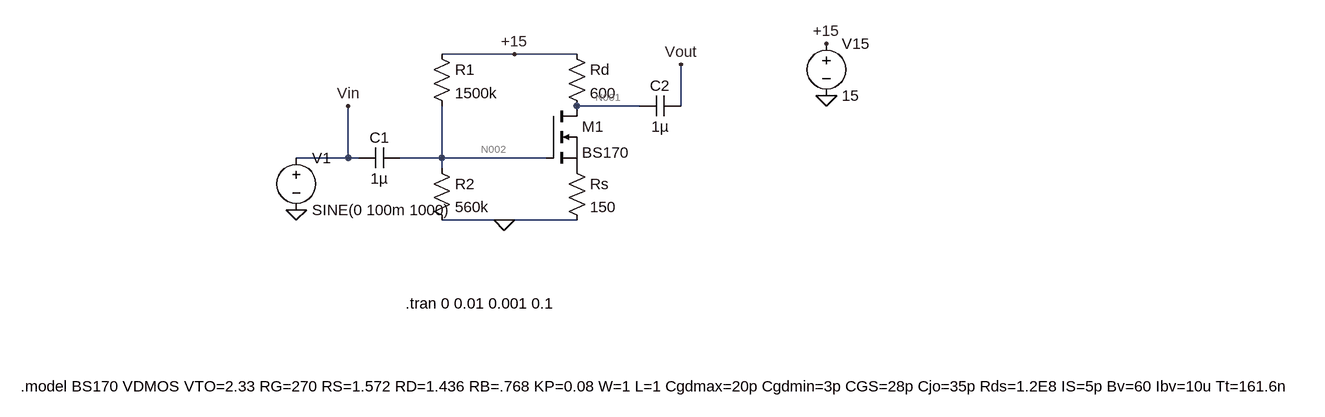
[diagram p0: schematic lab3.asc]
lab3.asc, the LTspice schematic file:
Version 4
SHEET 1 2216 680
WIRE -112 48 -224 48
WIRE -16 48 -112 48
WIRE 80 128 -16 128
WIRE 144 128 144 64
WIRE -368 208 -368 128
WIRE -368 208 -448 208
WIRE -352 208 -368 208
WIRE -224 208 -224 128
WIRE -224 208 -288 208
WIRE -64 208 -224 208
WIRE -224 224 -224 208
WIRE -128 304 -224 304
WIRE -16 304 -128 304
FLAG -128 304 0
FLAG 368 112 0
FLAG -112 48 +15
FLAG -448 288 0
FLAG 368 32 +15
FLAG -368 128 Vin
FLAG 144 64 Vout
SYMBOL nmos -64 128 R0
SYMATTR InstName M1
SYMATTR Value BS170
SYMBOL res -32 208 R0
SYMATTR InstName Rs
SYMATTR Value 150
SYMBOL res -32 32 R0
SYMATTR InstName Rd
SYMATTR Value 600
SYMBOL res -240 32 R0
SYMATTR InstName R1
SYMATTR Value 1500k
SYMBOL res -240 208 R0
SYMATTR InstName R2
SYMATTR Value 560k
SYMBOL voltage 368 16 R0
WINDOW 123 0 0 Left 0
WINDOW 39 0 0 Left 0
SYMATTR InstName V15
SYMATTR Value 15
SYMBOL voltage -448 192 R0
WINDOW 123 0 0 Left 0
WINDOW 39 0 0 Left 0
SYMATTR InstName V1
SYMATTR Value SINE(0 100m 1000)
SYMBOL cap -288 192 R90
WINDOW 0 0 32 VBottom 2
WINDOW 3 32 32 VTop 2
SYMATTR InstName C1
SYMATTR Value 1µ
SYMBOL cap 144 112 R90
WINDOW 0 0 32 VBottom 2
WINDOW 3 32 32 VTop 2
SYMATTR InstName C2
SYMATTR Value 1µ
TEXT -280 432 Left 2 !.tran 0 0.01 0.001 0.1
TEXT -872 560 Left 2 !.model BS170 VDMOS VTO=2.33 RG=270 RS=1.572 RD=1.436 RB=.768 KP=0.08 W=1 L=1 Cgdmax=20p Cgdmin=3p CGS=28p Cjo=35p Rds=1.2E8 IS=5p Bv=60 Ibv=10u Tt=161.6n

The netlist it stands for:
* lab3.asc
M1 N001 N002 P001 P001 BS170
Rs P001 0 150
Rd +15 N001 600
R1 +15 N002 1500k
R2 N002 0 560k
V15 +15 0 15
V1 Vin 0 SINE(0 100m 1000)
C1 N002 Vin 1µ
C2 Vout N001 1µ
.model NMOS NMOS
.model PMOS PMOS
.lib standard.mos
.tran 0 0.01 0.001 0.1
.model BS170 VDMOS VTO=2.33 RG=270 RS=1.572 RD=1.436 RB=.768 KP=0.08 W=1 L=1 Cgdmax=20p Cgdmin=3p CGS=28p Cjo=35p Rds=1.2E8 IS=5p Bv=60 Ibv=10u Tt=161.6n
.backanno
.end

* Results of the author's LTspice run, read from the files saved beside the schematic
* Operating Point, zero values left out:
*   V(n001) = 9.906 V
*   V(n002) = 4.078 V
*   V(p001) = 1.274 V
*   V(+15) = 15 V
*   V(vout) = 9.906 µV
*   Id(M1) = 8.491 mA
*   Is(M1) = -8.491 mA
*   I(R2) = 7.282 µA
*   I(R1) = 7.282 µA
*   I(Rd) = 8.491 mA
*   I(Rs) = 8.491 mA
*   I(V15) = -8.498 mA
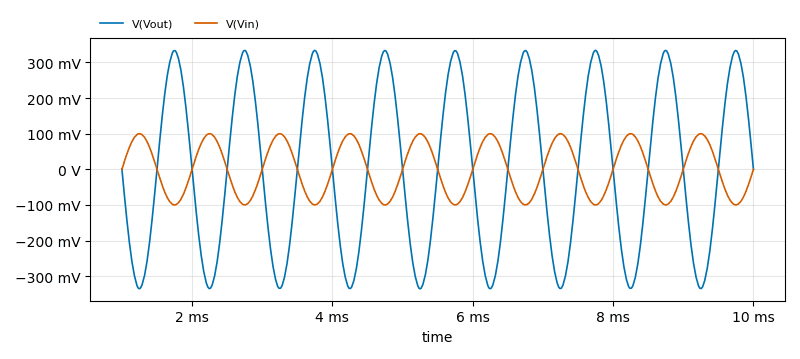
[diagram p1: Transient Analysis of lab3.asc, plotted from the saved traces]
* Transient Analysis, 1 run:
*   V(Vout): min -335.6 mV, max 334.1 mV, average -288.7 µV, rms 235.3 mV, last 31.07 µV
*   V(Vin): min -99.99 mV, max 100 mV, average 499.9 nV, rms 70.77 mV, last 0 V